# EasyEDA schematic LcsNodes-Turnout-Dock-B.00.01.json
TITLE: Sheet_1; REV: 1.0; Date: 2025-12-29; Sheet: 1/1; Drawn By: helmut-f; Company: Your Company
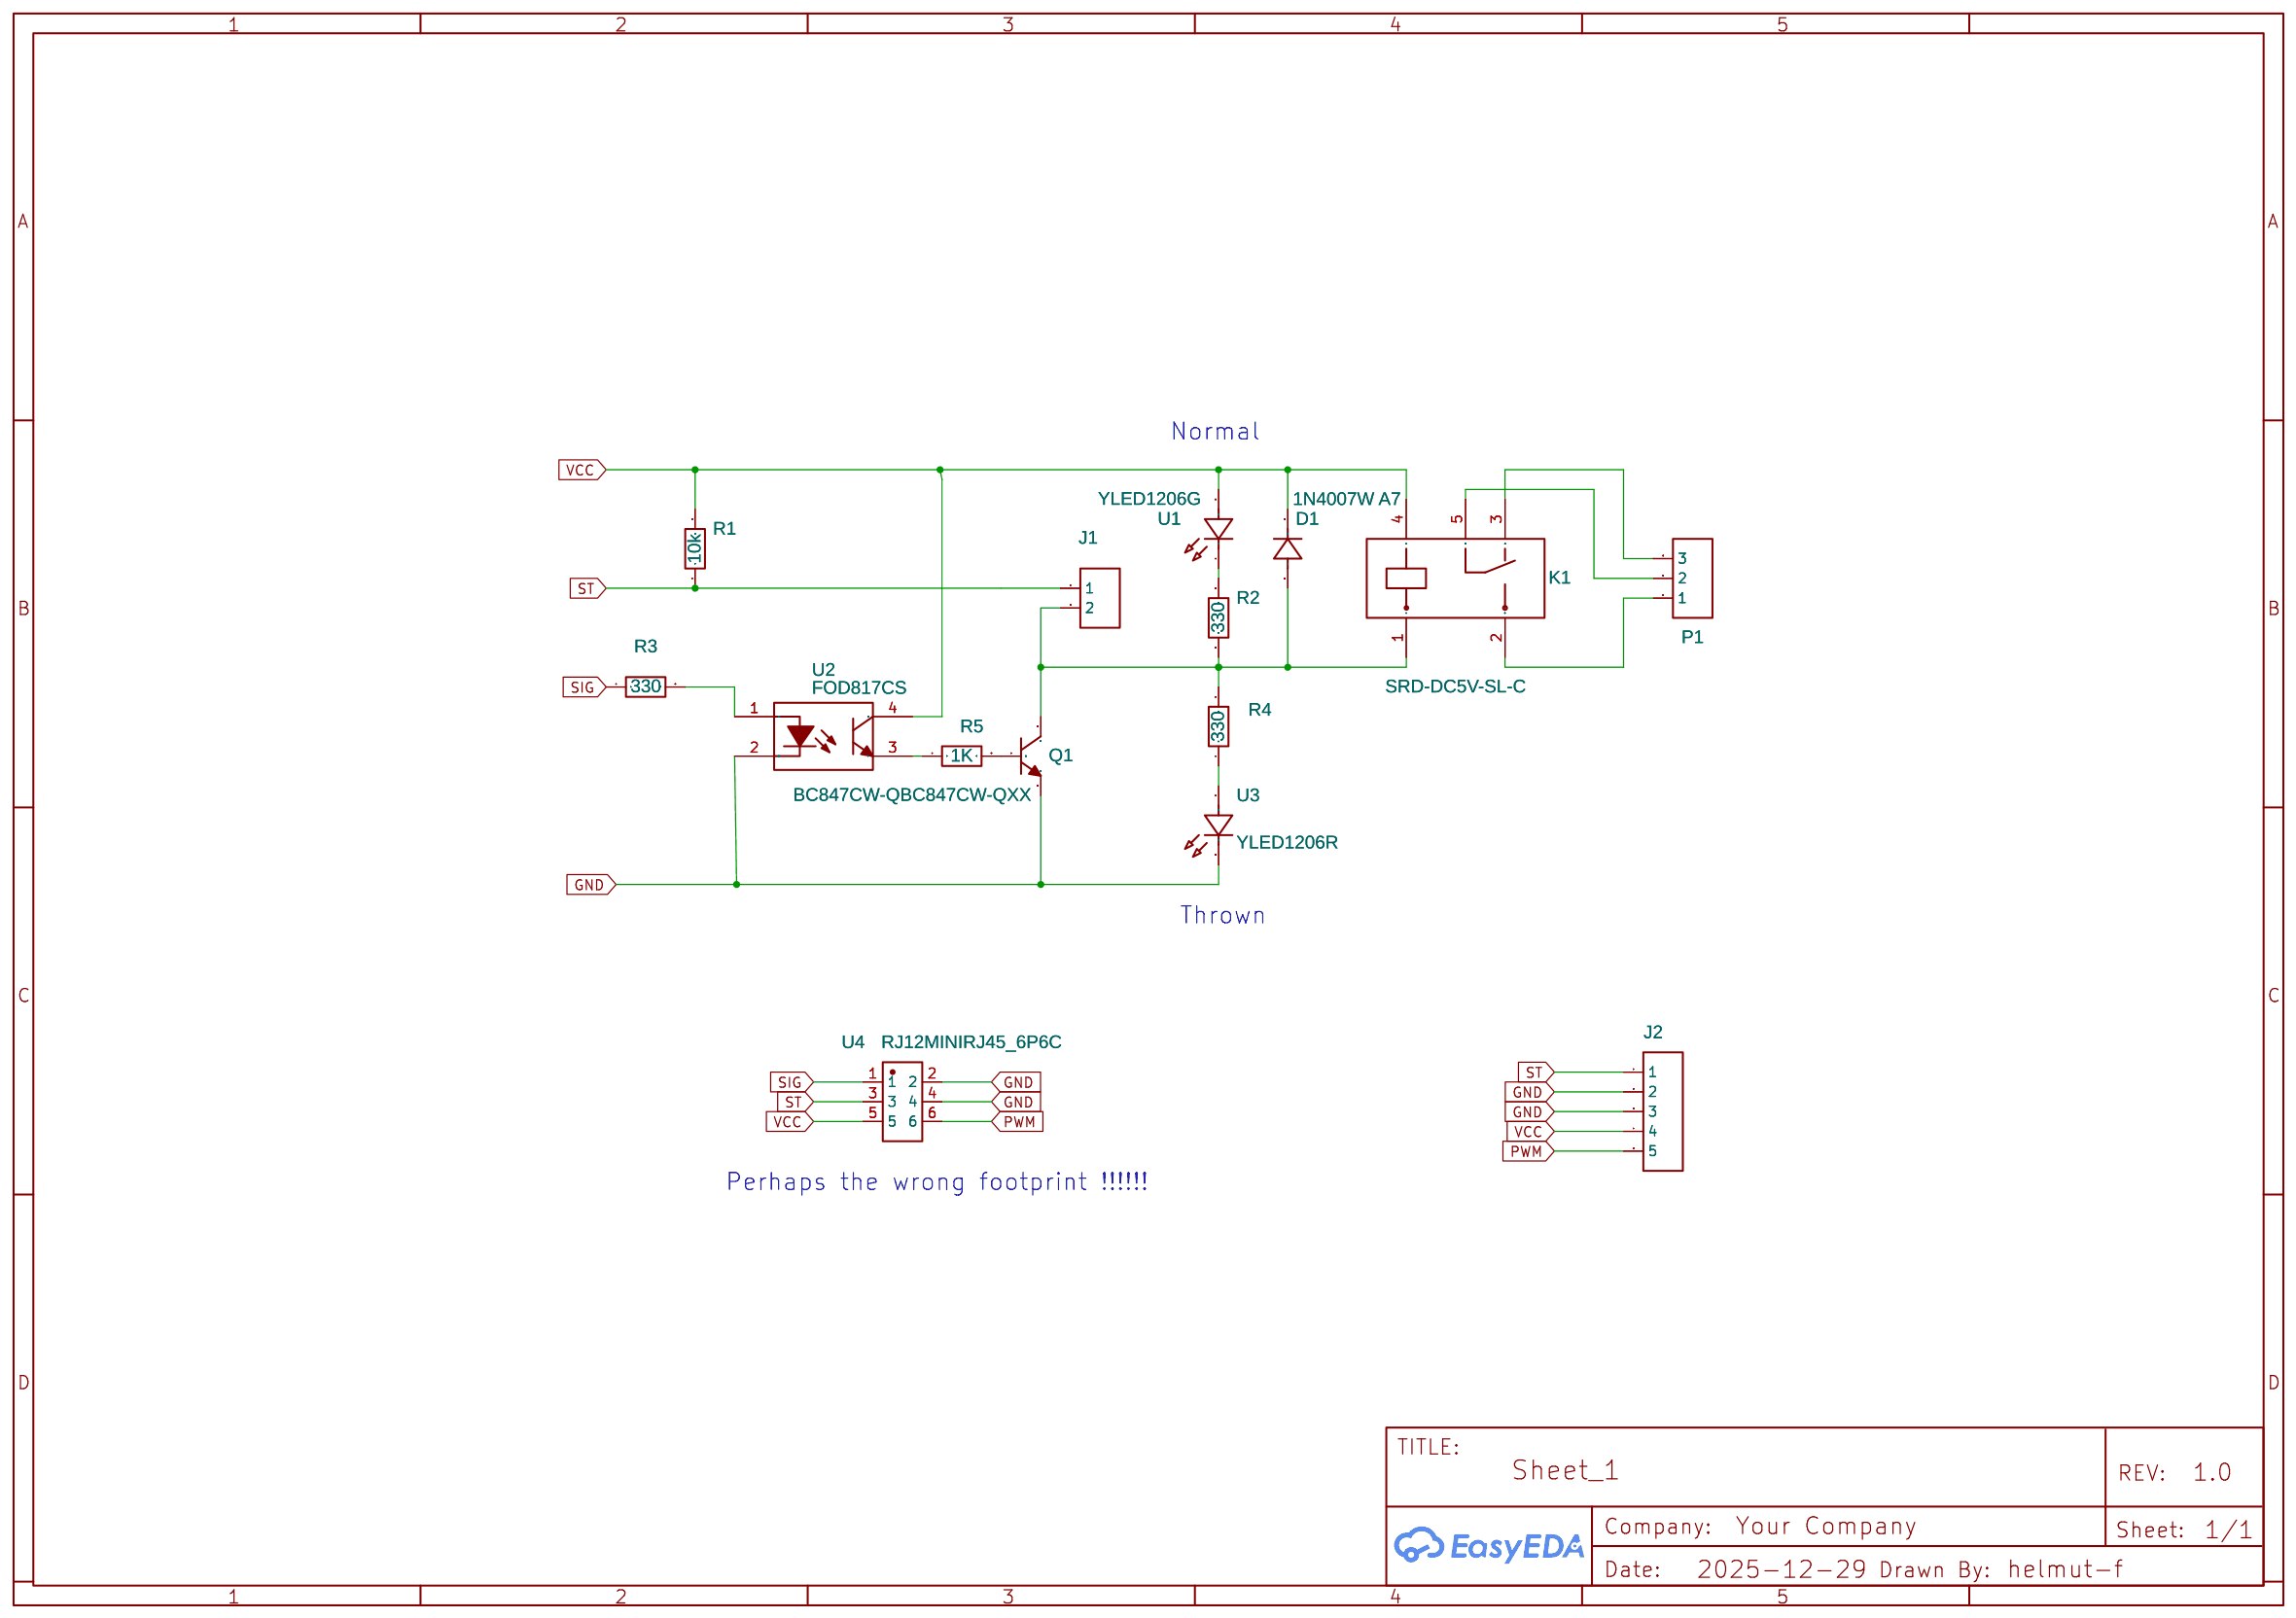
[diagram p0: schematic sheet]

## Parts
D1  1N4007W A7  [SOD-123_L2.8-W1.8-LS3.7-RD-3]
J1  HDR-M-2.54_1x2  [HDR-M-2.54_1X2]
J2  HDR-M-2.54_1x5  [HDR-M-2.54_1X5]
K1  SRD-DC5V-SL-C  [RELAY-TH_SRD-DCXXV-SL-C]
P1  CONN-TH_3P-P5.08  [CONN-TH_3P-P5.08]
Q1  BC847CW-QBC847CW-QXX  [SOT-323-3_L2.0-W1.3-P1.30-LS2.1-BR]
R1  10k  [R1206]
R2  330  [R1206]
R3  330  [R1206]
R4  330  [R1206]
R5  1K  [R1206]
U1  YLED1206G  [LED1206-RD]
U2  FOD817CS  [SMD-4_L4.6-W6.4-P2.54-LS10.0-BL]
U3  YLED1206R  [LED1206-FD]
U4  RJ12MINIRJ45_6P6C  [RJ12-TH_RJ12MINIRJ45_6P6C]

## Library data of the parts
D1 = 1N4007W A7: Supplier: LCSC; Supplier Part: C2857183; Manufacturer: JSMSEMI(杰盛微); JLCPCB Part Class: Extended Part; Contributor: lcsc
J1 = HDR-M-2.54_1x2: Supplier Part: C124375; Supplier: LCSC; Contributor: LCEDA_Lib
J2 = HDR-M-2.54_1x5: Supplier Part: C358687; Supplier: LCSC; Contributor: LCEDA_Lib
K1 = SRD-DC5V-SL-C: Contributor: LCSC; Supplier: LCSC; Supplier Part: C688865; Manufacturer: null; JLCPCB Part Class: Extended Part
P1 = CONN-TH_3P-P5.08: Supplier: LCSC; Contributor: LCEDA_Lib
Q1 = BC847CW-QBC847CW-QXX: Contributor: lcsc; Supplier: LCSC; Supplier Part: C5182829; Manufacturer: Nexperia(安世); JLCPCB Part Class: Extended Part
R1-R5 = R_0805_EU: Contributor: LCEDA_Lib
U1 = YLED1206G: Supplier: LCSC; Supplier Part: C30584801; Manufacturer: YONGYUTAI(永裕泰); Contributor: lcsc; JLCPCB Part Class: Extended Part
U2 = FOD817CS: Contributor: LCSC; Supplier: LCSC; Supplier Part: C900912; Manufacturer: onsemi(安森美); JLCPCB Part Class: Extended Part
U3 = YLED1206R: Supplier: LCSC; Supplier Part: C28310439; Manufacturer: YONGYUTAI(永裕泰); JLCPCB Part Class: Extended Part; Contributor: lcsc
U4 = RJ12MINIRJ45_6P6C: Supplier: LCSC; Supplier Part: C9900103926; Manufacturer: null; Contributor: lcsc; JLCPCB Part Class: Extended Part

## Nets
GND: J2.2 J2.3 Q1.2(E) U2.2(C) U3.2 U4.2 U4.4
VCC: D1.1(C) J2.4 K1.4 R1.2 U1.2(A) U2.4(C) U4.5
PWM: J2.5 U4.6
SIG: R3.1 U4.1
ST: J1.1 J2.1 R1.1 U4.3
Net-(D1-2): D1.2(A) J1.2 K1.1 Q1.3(C) R2.1 R4.2
Net-(K1-2): K1.2 P1.1
Net-(K1-3): K1.3 P1.3
Net-(K1-5): K1.5 P1.2
Net-(Q1-1): Q1.1(B) R5.2
Net-(R2-2): R2.2 U1.1(K)
Net-(R3-2): R3.2 U2.1(A)
Net-(R4-1): R4.1 U3.1
Net-(R5-1): R5.1 U2.3(E)

## Notes on the sheet
- Normal
- Thrown
- Perhaps the wrong footprint !!!!!!
